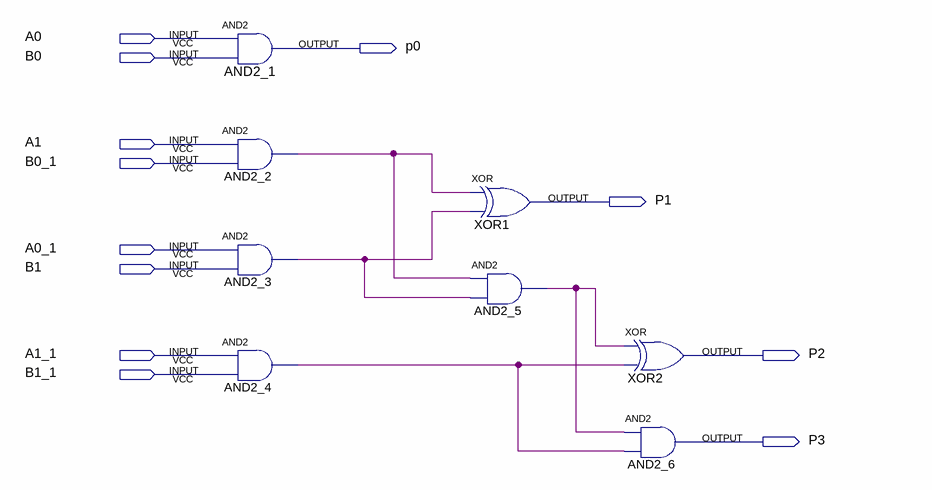
[diagram p0: schematic sheet]
// Quartus schematic Two_Bit_Multiplier.bdf as structural Verilog: 8 symbols, 12 pins
module Two_Bit_Multiplier (
  input  A0,
  input  B0,
  input  A1,
  input  B0_1,
  input  A0_1,
  input  B1,
  input  A1_1,
  input  B1_1,
  output p0,
  output P1,
  output P2,
  output P3
);

  wire AND2_2_out, AND2_3_out, AND2_4_out, AND2_5_out;

  and AND2_1 (p0, A0, B0);
  and AND2_2 (AND2_2_out, A1, B0_1);
  and AND2_3 (AND2_3_out, A0_1, B1);
  and AND2_4 (AND2_4_out, A1_1, B1_1);
  xor XOR1 (P1, AND2_2_out, AND2_3_out);
  and AND2_5 (AND2_5_out, AND2_2_out, AND2_3_out);
  xor XOR2 (P2, AND2_5_out, AND2_4_out);
  and AND2_6 (P3, AND2_5_out, AND2_4_out);
endmodule
